# Altium schematic sheet Sheet5.SchDoc
size A3
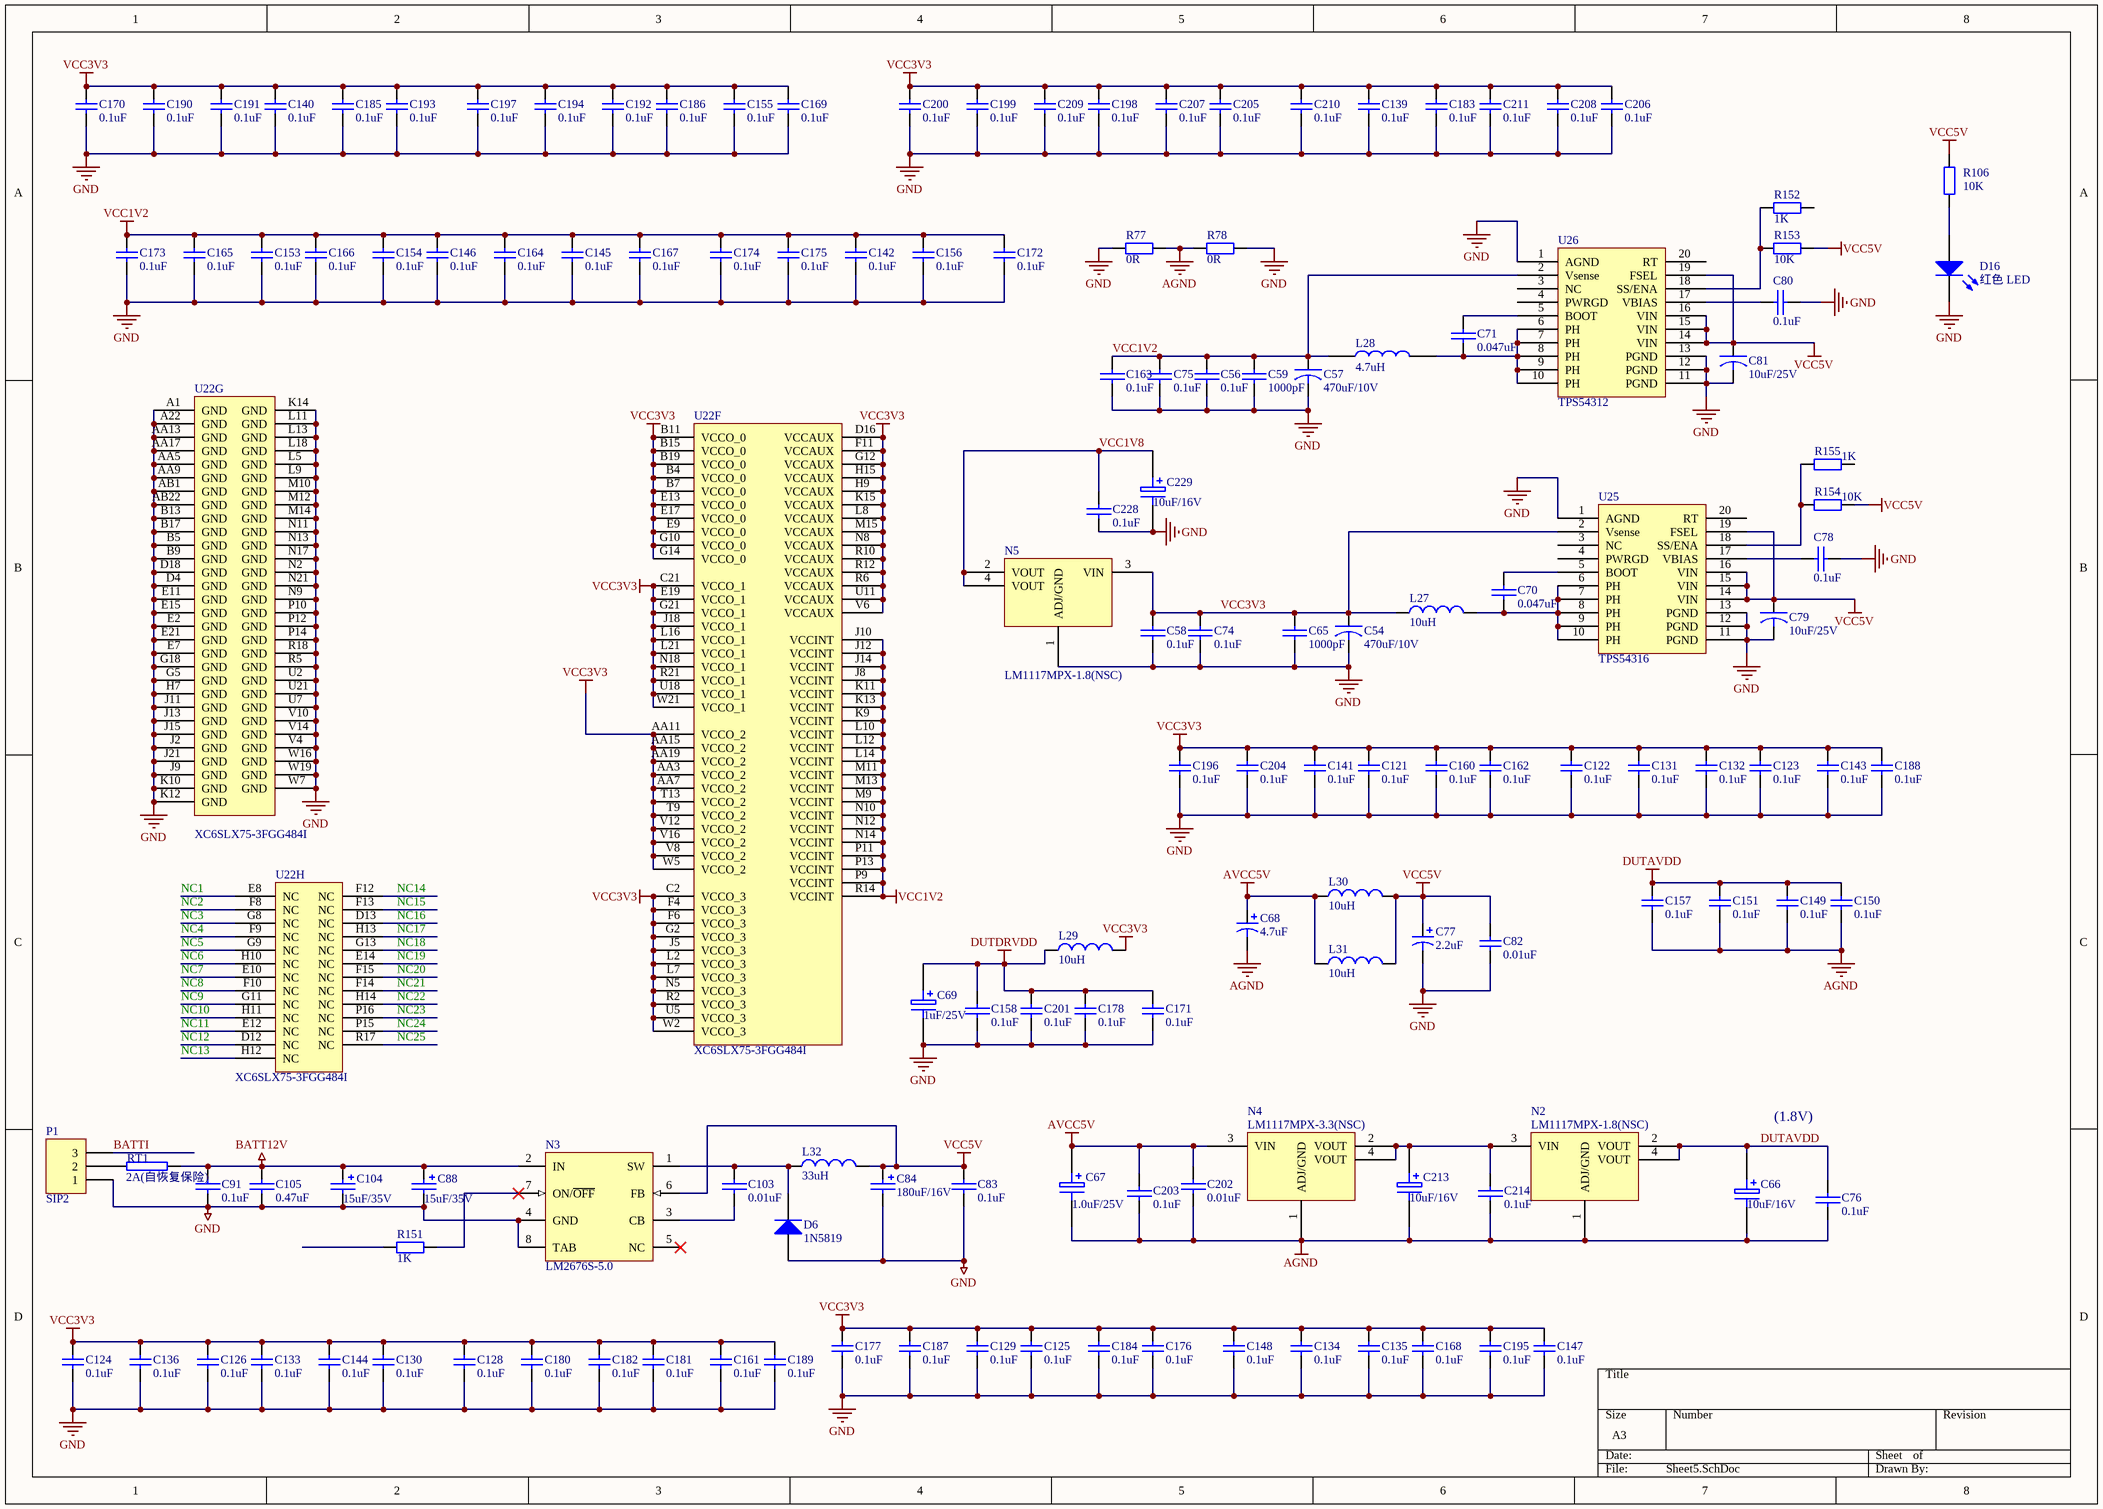
[diagram p0: Sheet5.SchDoc]

## Parts
C54  470uF/10V  [CAP-D]
C56  0.1uF  [0603C]
C57  470uF/10V  [CAP-D]
C58  0.1uF  [0603C]
C59  1000pF  [0603C]
C65  1000pF  [0603C]
C66  10uF/16V  [1210C]
C67  1.0uF/25V  [1210C]
C68  4.7uF  [CAP-B]
C69  1uF/25V  [1206C]
C70  0.047uF  [0603C]
C71  0.047uF  [0603C]
C74  0.1uF  [0603C]
C75  0.1uF  [0603C]
C76  0.1uF  [0603C]
C77  2.2uF  [1210C]
C78  0.1uF  [0603C]
C79  10uF/25V  [CAP-B]
C80  0.1uF  [0603C]
C81  10uF/25V  [CAP-B]
C82  0.01uF  [0603C]
C83  0.1uF  [0805C]
C84  180uF/16V  [CAP-C]
C88  15uF/35V  [CAP-D]
C91  0.1uF  [0805C]
C103  0.01uF  [0603C]
C104  15uF/35V  [CAP-D]
C105  0.47uF  [0805C]
C121  0.1uF  [0402C]
C122  0.1uF  [0402C]
C123  0.1uF  [0402C]
C124  0.1uF  [0402C]
C125  0.1uF  [0402C]
C126  0.1uF  [0402C]
C128  0.1uF  [0402C]
C129  0.1uF  [0402C]
C130  0.1uF  [0402C]
C131  0.1uF  [0402C]
C132  0.1uF  [0402C]
C133  0.1uF  [0402C]
C134  0.1uF  [0402C]
C135  0.1uF  [0402C]
C136  0.1uF  [0402C]
C139  0.1uF  [0402C]
C140  0.1uF  [0402C]
C141  0.1uF  [0402C]
C142  0.1uF  [0402C]
C143  0.1uF  [0402C]
C144  0.1uF  [0402C]
C145  0.1uF  [0402C]
C146  0.1uF  [0402C]
C147  0.1uF  [0402C]
C148  0.1uF  [0402C]
C149  0.1uF  [0402C]
C150  0.1uF  [0402C]
C151  0.1uF  [0402C]
C153  0.1uF  [0402C]
C154  0.1uF  [0402C]
C155  0.1uF  [0402C]
C156  0.1uF  [0402C]
C157  0.1uF  [0402C]
C158  0.1uF  [0402C]
C160  0.1uF  [0402C]
C161  0.1uF  [0402C]
C162  0.1uF  [0402C]
C163  0.1uF  [0402C]
C164  0.1uF  [0402C]
C165  0.1uF  [0402C]
C166  0.1uF  [0402C]
C167  0.1uF  [0402C]
C168  0.1uF  [0402C]
C169  0.1uF  [0402C]
C170  0.1uF  [0402C]
C171  0.1uF  [0402C]
C172  0.1uF  [0402C]
C173  0.1uF  [0402C]
C174  0.1uF  [0402C]
C175  0.1uF  [0402C]
C176  0.1uF  [0402C]
C177  0.1uF  [0402C]
C178  0.1uF  [0402C]
C180  0.1uF  [0402C]
C181  0.1uF  [0402C]
C182  0.1uF  [0402C]
C183  0.1uF  [0402C]
C184  0.1uF  [0402C]
C185  0.1uF  [0402C]
C186  0.1uF  [0402C]
C187  0.1uF  [0402C]
C188  0.1uF  [0402C]
C189  0.1uF  [0402C]
C190  0.1uF  [0402C]
C191  0.1uF  [0402C]
C192  0.1uF  [0402C]
C193  0.1uF  [0402C]
C194  0.1uF  [0402C]
C195  0.1uF  [0402C]
C196  0.1uF  [0402C]
C197  0.1uF  [0402C]
C198  0.1uF  [0402C]
C199  0.1uF  [0402C]
C200  0.1uF  [0402C]
C201  0.1uF  [0402C]
C202  0.01uF  [0603C]
C203  0.1uF  [0603C]
C204  0.1uF  [0402C]
C205  0.1uF  [0402C]
C206  0.1uF  [0402C]
C207  0.1uF  [0402C]
C208  0.1uF  [0402C]
C209  0.1uF  [0402C]
C210  0.1uF  [0402C]
C211  0.1uF  [0402C]
C213  10uF/16V  [1210C]
C214  0.1uF  [0603C]
C228  0.1uF  [0603C]
C229  10uF/16V  [1210C]
D6  1N5819  [L3583A]
D16  红色 LED  [0805LED]
L27  10uH  [L5R2]
L28  4.7uH  [L5R2]
L29  10uH  [1206L]
L30  10uH  [1206L]
L31  10uH  [1206L]
L32  33uH  [L5R2]
N2  LM1117MPX-1.8(NSC)  [SOT-223]
N3  LM2676S-5.0  [TS7B_N]
N4  LM1117MPX-3.3(NSC)  [SOT-223]
N5  LM1117MPX-1.8(NSC)  [SOT-223]
P1  SIP2  [SIP3X]
R77  0R  [1206R]
R78  0R  [1206R]
R106  10K  [0603R]
R151  1K  [0603R]
R152  1K  [0603R]
R153  10K  [0603R]
R154  10K  [0603R]
R155  1K  [0603R]
RT1  2A(自恢复保险)  [1812X]
U22  XC6SLX75-3FGG484I  [FGG484]  (parts F,G,H of 8)
U25  TPS54316  [SOP20]
U26  TPS54312  [SOP20]

## Nets
AGND: C66.2 C67.2 C68.2 C76.2 C149.1 C150.1 C151.1 C157.1 C202.2 C203.2 C213.2 C214.2 N2.1(ADJ/GND) N4.1(ADJ/GND) R77.1 R78.2
AVCC5V: C67.1 C68.1 C202.1 C203.1 L30.1 L31.1 N4.3(VIN)
BATT12V: C88.1 C91.1 C104.1 C105.1 N3.2(IN) RT1.2
DUTAVDD: C66.1 C76.1 C149.2 C150.2 C151.2 C157.2 N2.2(VOUT) N2.4(VOUT)
DUTDRVDD: C69.1 C158.1 C171.2 C178.2 C201.2 L29.1
GND: C54.2 C56.2 C57.2 C58.2 C59.1 C65.1 C69.2 C74.2 C75.2 C77.2 C78.2 C79.2 C80.2 C81.2 C82.2 C83.2 C84.2 C88.2 C91.2 C104.2 C105.2 C121.1 C122.1 C123.1 C124.1 C125.1 C126.1 C128.1 C129.1 C130.1 C131.1 C132.1 C133.1 C134.1 C135.1 C136.1 C139.1 C140.1 C141.1 C142.1 C143.1 C144.1 C145.1 C146.1 C147.1 C148.1 C153.1 C154.1 C155.1 C156.1 C158.2 C160.1 C161.1 C162.1 C163.2 C164.1 C165.1 C166.1 C167.1 C168.1 C169.1 C170.1 C171.1 C172.1 C173.1 C174.1 C175.1 C176.1 C177.1 C178.1 C180.1 C181.1 C182.1 C183.1 C184.1 C185.1 C186.1 C187.1 C188.1 C189.1 C190.1 C191.1 C192.1 C193.1 C194.1 C195.1 C196.1 C197.1 C198.1 C199.1 C200.1 C201.1 C204.1 C205.1 C206.1 C207.1 C208.1 C209.1 C210.1 C211.1 C228.2 C229.2 D6.1(A) D16.2(K) N3.4(GND) N3.8(TAB) N5.1(ADJ/GND) P1.1 R77.2 R78.1 U22.A1(GND) U22.A22(GND) U22.AA5(GND) U22.AA9(GND) U22.AA13(GND) U22.AA17(GND) U22.AB1(GND) U22.AB22(GND) U22.B5(GND) U22.B9(GND) U22.B13(GND) U22.B17(GND) U22.D4(GND) U22.D18(GND) U22.E2(GND) U22.E7(GND) U22.E11(GND) U22.E15(GND) U22.E21(GND) U22.G5(GND) U22.G18(GND) U22.H7(GND) U22.J2(GND) U22.J9(GND) U22.J11(GND) U22.J13(GND) U22.J15(GND) U22.J21(GND) U22.K10(GND) U22.K12(GND) U22.K14(GND) U22.L5(GND) U22.L9(GND) U22.L11(GND) U22.L13(GND) U22.L18(GND) U22.M10(GND) U22.M12(GND) U22.M14(GND) U22.N2(GND) U22.N9(GND) U22.N11(GND) U22.N13(GND) U22.N17(GND) U22.N21(GND) U22.P10(GND) U22.P12(GND) U22.P14(GND) U22.R5(GND) U22.R18(GND) U22.U2(GND) U22.U7(GND) U22.U21(GND) U22.V4(GND) U22.V10(GND) U22.V14(GND) U22.W7(GND) U22.W16(GND) U22.W19(GND) U25.1(AGND) U25.11(PGND) U25.12(PGND) U25.13(PGND) U26.1(AGND) U26.11(PGND) U26.12(PGND) U26.13(PGND)
VCC1V2: C56.1 C57.1 C59.2 C75.1 C142.2 C145.2 C146.2 C153.2 C154.2 C156.2 C163.1 C164.2 C165.2 C166.2 C167.2 C172.2 C173.2 C174.2 C175.2 L28.1 U22.J8(VCCINT) U22.J10(VCCINT) U22.J12(VCCINT) U22.J14(VCCINT) U22.K9(VCCINT) U22.K11(VCCINT) U22.K13(VCCINT) U22.L10(VCCINT) U22.L12(VCCINT) U22.L14(VCCINT) U22.M9(VCCINT) U22.M11(VCCINT) U22.M13(VCCINT) U22.N10(VCCINT) U22.N12(VCCINT) U22.N14(VCCINT) U22.P9(VCCINT) U22.P11(VCCINT) U22.P13(VCCINT) U22.R14(VCCINT) U26.2(Vsense)
VCC3V3: C54.1 C58.1 C65.2 C74.1 C121.2 C122.2 C123.2 C124.2 C125.2 C126.2 C128.2 C129.2 C130.2 C131.2 C132.2 C133.2 C134.2 C135.2 C136.2 C139.2 C140.2 C141.2 C143.2 C144.2 C147.2 C148.2 C155.2 C160.2 C161.2 C162.2 C168.2 C169.2 C170.2 C176.2 C177.2 C180.2 C181.2 C182.2 C183.2 C184.2 C185.2 C186.2 C187.2 C188.2 C189.2 C190.2 C191.2 C192.2 C193.2 C194.2 C195.2 C196.2 C197.2 C198.2 C199.2 C200.2 C204.2 C205.2 C206.2 C207.2 C208.2 C209.2 C210.2 C211.2 L27.1 L29.2 N5.3(VIN) U22.AA3(VCCO_2) U22.AA7(VCCO_2) U22.AA11(VCCO_2) U22.AA15(VCCO_2) U22.AA19(VCCO_2) U22.B4(VCCO_0) U22.B7(VCCO_0) U22.B11(VCCO_0) U22.B15(VCCO_0) U22.B19(VCCO_0) U22.C2(VCCO_3) U22.C21(VCCO_1) U22.D16(VCCAUX) U22.E9(VCCO_0) U22.E13(VCCO_0) U22.E17(VCCO_0) U22.E19(VCCO_1) U22.F4(VCCO_3) U22.F6(VCCO_3) U22.F11(VCCAUX) U22.G2(VCCO_3) U22.G10(VCCO_0) U22.G12(VCCAUX) U22.G14(VCCO_0) U22.G21(VCCO_1) U22.H9(VCCAUX) U22.H15(VCCAUX) U22.J5(VCCO_3) U22.J18(VCCO_1) U22.K15(VCCAUX) U22.L2(VCCO_3) U22.L7(VCCO_3) U22.L8(VCCAUX) U22.L16(VCCO_1) U22.L21(VCCO_1) U22.M15(VCCAUX) U22.N5(VCCO_3) U22.N8(VCCAUX) U22.N18(VCCO_1) U22.R2(VCCO_3) U22.R6(VCCAUX) U22.R10(VCCAUX) U22.R12(VCCAUX) U22.R21(VCCO_1) U22.T9(VCCO_2) U22.T13(VCCO_2) U22.U5(VCCO_3) U22.U11(VCCAUX) U22.U18(VCCO_1) U22.V6(VCCAUX) U22.V8(VCCO_2) U22.V12(VCCO_2) U22.V16(VCCO_2) U22.W2(VCCO_3) U22.W5(VCCO_2) U22.W21(VCCO_1) U25.2(Vsense)
VCC5V: C77.1 C79.1 C81.1 C82.1 C83.1 C84.1 L30.2 L31.2 L32.2 N3.6(FB) R106.2 R153.1 R154.1 U25.14(VIN) U25.15(VIN) U25.16(VIN) U25.19(FSEL) U26.14(VIN) U26.15(VIN) U26.16(VIN) U26.19(FSEL)
BATTI: P1.3
NC1: U22.E8(NC)
NC2: U22.F8(NC)
NC3: U22.G8(NC)
NC4: U22.F9(NC)
NC5: U22.G9(NC)
NC6: U22.H10(NC)
NC7: U22.E10(NC)
NC8: U22.F10(NC)
NC9: U22.G11(NC)
NC10: U22.H11(NC)
NC11: U22.E12(NC)
NC12: U22.D12(NC)
NC13: U22.H12(NC)
NC14: U22.F12(NC)
NC15: U22.F13(NC)
NC16: U22.D13(NC)
NC17: U22.H13(NC)
NC18: U22.G13(NC)
NC19: U22.E14(NC)
NC20: U22.F15(NC)
NC21: U22.F14(NC)
NC22: U22.H14(NC)
NC23: U22.P16(NC)
NC24: U22.P15(NC)
NC25: U22.R17(NC)
VCC1V8: C228.1 C229.1 N5.2(VOUT) N5.4(VOUT)
NetC70_1: C70.1 L27.2 U25.6(PH) U25.7(PH) U25.8(PH) U25.9(PH) U25.10(PH)
NetC70_2: C70.2 U25.5(BOOT)
NetC71_1: C71.1 L28.2 U26.6(PH) U26.7(PH) U26.8(PH) U26.9(PH) U26.10(PH)
NetC71_2: C71.2 U26.5(BOOT)
NetC78_1: C78.1 U25.17(VBIAS)
NetC80_1: C80.1 U26.17(VBIAS)
NetC103_1: C103.1 D6.2(K) L32.1 N3.1(SW)
NetC103_2: C103.2 N3.3(CB)
NetC213_1: C213.1 C214.1 N2.3(VIN) N4.2(VOUT) N4.4(VOUT)
NetD16_1: D16.1(A) R106.1
NetN3_7: N3.7(ON/~{OFF}) R151.1
NetP1_2: P1.2 RT1.1
NetR152_2: R152.2 R153.2 U26.18(SS/ENA)
NetR154_2: R154.2 R155.2 U25.18(SS/ENA)

Not connected (* = marked no-connect by the designer): N3 5(NC)*; R151 2; R152 1; R155 1; U25 3(NC) 4(PWRGD) 20(RT); U26 3(NC) 4(PWRGD) 20(RT)

## Notes on the sheet
- (1.8V)

## Library data of the parts
C54 C57 C79 C81 = CAPACITOR
C56 C58 C59 C65 C70 C71 C74-C76 C78 C80 C83 C91 C103 C105 C158 C163 C202 C203 C214 C228 = CAP: Capacitor
C66 C67 C69 C213 C229 = ELECTRO1: Electrolytic Capacitor
C68 C77 = Cap Pol1: Polarized Capacitor (Radial); Published: 8-Jun-2000; LatestRevisionDate: 17-Jul-2002; LatestRevisionNote: Re-released for DXP Platform.; PackageReference: RB7.6-15; Publisher: Altium Limited
  C68: Value: 4.7uF
  C77: Value: 2.2uF
C82 C121-C126 C128-C136 C139-C151 C153-C157 C160-C162 C164-C178 C180-C201 C204-C211 = Cap: Capacitor; Published: 8-Jun-2000; LatestRevisionDate: 17-Jul-2002; LatestRevisionNote: Re-released for DXP Platform.; Publisher: Altium Limited
  C82: PackageReference: RAD-0.3; Value: 0.01uF
  C121-C126 C128-C136 C139-C151 C153-C157 C160-C162 C164-C178 C180-C201 C204-C211: PackageReference: 0805; Value: 0.1uF
C84 C88 C104 = CAP+
D6 = Diode: Default Diode; Published: 8-Jun-2000; LatestRevisionDate: 17-Jul-2002; LatestRevisionNote: Re-released for DXP Platform.; PackageVersion: Sep-1996; PackageReference: SMC; Publisher: Altium Limited; Code_JEDEC: DO-214-AB
D16 = LED0: Typical INFRARED GaAs LED; Published: 8-Jun-2000; LatestRevisionDate: 08-Jul-2005; LatestRevisionNote: Mech Layer 1 removed.; PackageReference: LED-0; Publisher: Altium Limited
L27 L29-L32 = Inductor: Code_IEC: 1005; Published: 8-Jun-2000; LatestRevisionDate: 29-May-2009; LatestRevisionNote: IPC-7351 Footprint Added.; PackageReference: 0402-A; Publisher: Altium Limited; PackageDescription: Chip Inductor; Code_JEITA: 0402
  L27 L29-L31: Value: 10uH
  L32: Value: 33uH
L28 = INDUCTOR1
N2 N5 = LM1117: LM1117MPX-3.3(NSC)
N3 = LM2676S-5.0: SIMPLE SWITCHER High Efficiency 3A Step-Down Voltage Regulator; Manufacturer: National Semiconductor; PackageTopMarking: NSUZXYTT*LM2676*S-5.0; PowerWise: N; FirstPublished: 4-Dec-2008; DatasheetVersion: Feb-2008; PackageVersion: revE, Jul-2003; PackageReference: TS7B; Publisher: Altium Limited; PackageDescription: TO-263, Molded, .400 x .390 x .180in Body, 7 Lead, .050in Pitch, Surface Mount; CompType: Switcher; PartNumber: LM2676S-5.0; RoHS: O; PinCount: 7; DigiKeyPartNumber: LM2676S-5.0-ND; Code_JEDEC: MO-169-AC; ComponentLink1Description: LM2676 Datasheet; ComponentLink1URL: http://www.national.com/ds/LM/LM2676.pdf; ComponentLink2Description: LM2676 Web Page; ComponentLink2URL: http://www.national.com/pf/LM/LM2676.html; ComponentLink3Description: TS7B Package Page; ComponentLink3URL: http://www.national.com/packaging/folders/ts7b.html
N4 = LM1117
P1 = Header 3: Header, 3-Pin; LatestRevisionDate: 17-Jul-2002; LatestRevisionNote: Re-released for DXP Platform.; Publisher: Altium Limited
R77 R78 R106 R153 R154 = Res2: Resistor; Published: 8-Jun-2000; LatestRevisionDate: 17-Jul-2002; LatestRevisionNote: Re-released for DXP Platform.; PackageReference: AXIAL-0.4; Publisher: Altium Limited
  R77 R78: Value: 0R
  R106 R153 R154: Value: 10K
R151 R152 R155 = Res2: Resistor; Value: 10K; Published: 8-Jun-2000; LatestRevisionDate: 17-Jul-2002; LatestRevisionNote: Re-released for DXP Platform.; PackageReference: AXIAL-0.4; Publisher: Altium Limited
RT1 = RES2
U22 = XC6SLX45-L1FGG484I: Spartan-6 LX 1.0V FPGA, 316 User I/Os, 484-Ball Fine-Pitch BGA (1.0mm Pitch), Low Power Version, Industrial Grade, Pb-Free; FirstPublished: 17-Nov-2009; DatasheetVersion: ver1.3, Nov-2009; PackageVersion: ver1.1, Dec-2008; PackageReference: FGG484; Publisher: Altium Limited; PackageDescription: 484-Ball Fine Pitch Ball Grid Array 1.00 mm Pitch (FGG484) - Pb-Free; Code_JEDEC: MS-034-AAJ-1; Code_IPC: BGA100P22X22-484; ComponentLink1Description: Spartan-6 Datasheet; ComponentLink1URL: http://www.xilinx.com/support/documentation/data_sheets/ds160.pdf; ComponentLink2Description: Pinout Specification; ComponentLink2URL: http://www.xilinx.com/support/documentation/user_guides/ug385.pdf; ComponentLink3Description: FGG484 Package Drawing; ComponentLink3URL: http://www.xilinx.com/support/documentation/package_specs/fg484.pdf; ComponentLink4Description: Spartan-6 Documents; ComponentLink4URL: http://www.xilinx.com/support/documentation/spartan-6.htm; ComponentLink5Description: Xilinx.com Home; ComponentLink5URL: http://www.xilinx.com
U25 = TPS54312